# Altium schematic sheet MeasurevoltageCurrent .SchDoc
size A4
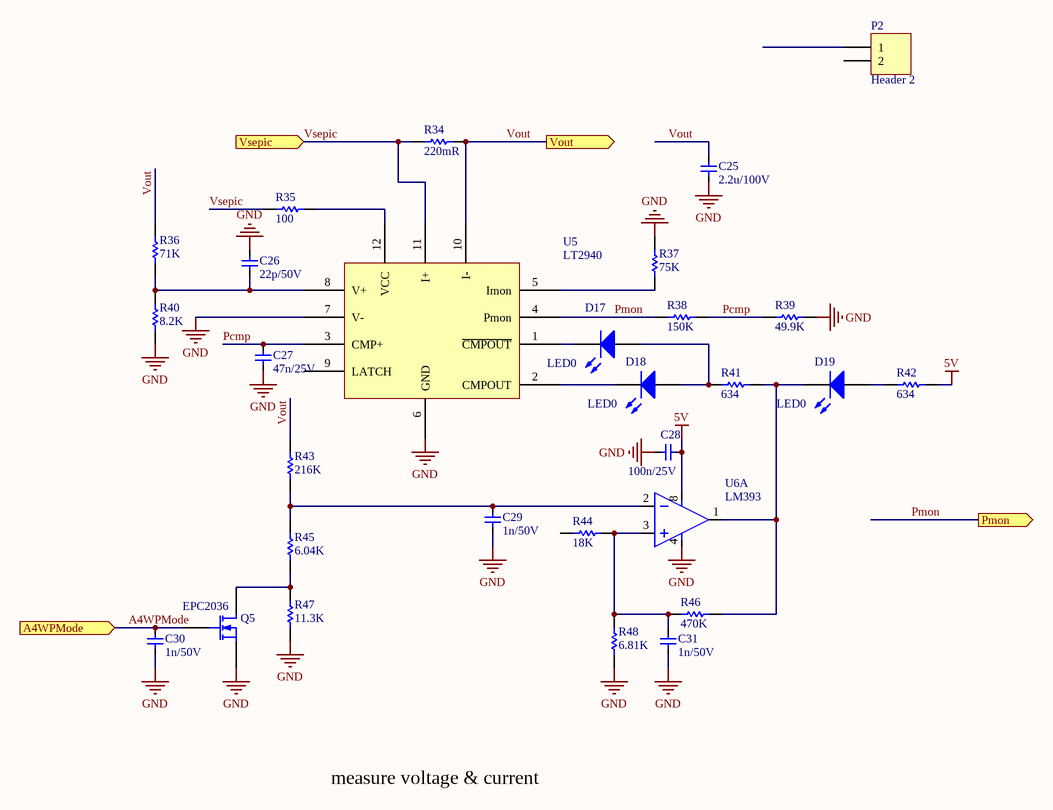
[diagram p0: MeasurevoltageCurrent .SchDoc]

## Parts
C25  2.2u/100V  [0603]
C26  22p/50V  [0603]
C27  47n/25V  [0603]
C28  100n/25V  [0603]
C29  1n/50V  [0603]
C30  1n/50V  [0603]
C31  1n/50V  [0603]
D17  LED0  [LED0805]
D18  LED0  [LED0805]
D19  LED0  [LED0805]
P2  Header 2  [HDR1X2]
Q5  EPC2036  [E3]
R34  value 220mR  [0603]  (hidden comment: Res1)
R35  value 100  [0603]  (hidden comment: Res1)
R36  value 71K  [0603]  (hidden comment: Res1)
R37  value 75K  [0603]  (hidden comment: Res1)
R38  value 150K  [0603]  (hidden comment: Res1)
R39  value 49.9K  [0603]  (hidden comment: Res1)
R40  value 8.2K  [0603]  (hidden comment: Res1)
R41  value 634  [0603]  (hidden comment: Res1)
R42  value 634  [0603]  (hidden comment: Res1)
R43  value 216K  [0603]  (hidden comment: Res1)
R44  value 18K  [0603]  (hidden comment: Res1)
R45  value 6.04K  [0603]  (hidden comment: Res1)
R46  value 470K  [0603]  (hidden comment: Res1)
R47  value 11.3K  [0603]  (hidden comment: Res1)
R48  value 6.81K  [0603]  (hidden comment: Res1)
U5  LT2940
U6  LM393  [SO8_L]  (part A of 2)

## Ports
A4WPMode (in), Pmon (out), Vout (out), Vsepic (in)

## Nets
5V: C28.1 R42.2 U6.8(gnd)
GND: C25.1 C26.1 C27.2 C28.2 C29.2 C30.2 C31.2 Q5.3(S) R37.1 R39.2 R40.1 R47.1 R48.1 U5.6(GND) U5.7(V-) U6.4(vcc)
A4WPMode: C30.1 Q5.2(G) ; port A4WPMode
Pcmp: C27.1 R38.2 R39.1 U5.3(CMP+)
Pmon: R38.1 U5.4(Pmon) ; port Pmon
Vout: C25.2 R34.1 R36.2 R43.2 U5.10(I-) ; port Vout
Vsepic: R34.2 R35.2 U5.11(I+) ; port Vsepic
NetC26_2: C26.2 R36.1 R40.2 U5.8(V+)
NetC29_1: C29.1 R43.1 R45.2 U6.2
NetC31_1: C31.1 R44.2 R46.1 R48.2 U6.3
NetD17_1: D17.1(A) D18.1(A) R41.1
NetD17_2: D17.2(K) U5.1(~{CMPOUT})
NetD18_2: D18.2(K) U5.2(CMPOUT)
NetD19_1: D19.1(A) R42.1
NetD19_2: D19.2(K) R41.2 R46.2 U6.1
NetQ5_1: Q5.1(D) R45.1 R47.2
NetR35_1: R35.1 U5.12(VCC)
NetR37_2: R37.2 U5.5(Imon)

Not connected (* = marked no-connect by the designer): P2 1 2; R44 1; U5 9(LATCH)

## Notes on the sheet
- measure voltage & current

## Library data of the parts
C25-C31 = CAP1: Capacitor
D17-D19 = LED0: Typical INFRARED GaAs LED; Published: 8-Jun-2000; LatestRevisionDate: 08-Jul-2005; LatestRevisionNote: Mech Layer 1 removed.; PackageReference: LED-0; Publisher: Altium Limited; PackageDescription: LED; 2 Leads
P2 = Header 2: Header, 2-Pin; LatestRevisionDate: 17-Jul-2002; LatestRevisionNote: Re-released for DXP Platform.; Publisher: Altium Limited
Q5 = MOSFET-N: N-Channel MOSFET; Published: 8-Jun-2000; LatestRevisionDate: 17-Jul-2002; LatestRevisionNote: Re-released for DXP Platform.; PackageVersion: 1995/1996; PackageReference: E3; Publisher: Altium Limited; PackageDescription: TO, Flat Index; 3 In-Line, Axial Leads; Body Dia. 4.6mm; Lead Dia. 0.5 mm (max)
R34-R48 = Res1: Resistor; Published: 8-Jun-2000; LatestRevisionDate: 17-Jul-2002; LatestRevisionNote: Re-released for DXP Platform.; PackageReference: AXIAL-0.3; Publisher: Altium Limited; PackageDescription: Axial Device, Thru-Hole; 2 Leads; 0.3 in Pin Spacing